# Altium schematic sheet RGB Video Controller.SchDoc: RGB Video Controller
size A4; Organization: Altium Limited; Address1: L3, 12a Rodborough Rd; Address2: Frenchs Forest; Address3: NSW; Address4: Australia 2086; Revision: 1; SheetNumber: 5; SheetTotal: 11; Alumno: Diego Caceres; Curso: R1051; Materia: Sistemas de Representación; Docentes: Ing. Perdomo, Ing. Fuoco, Ing. Giorno, Sr. Vergili
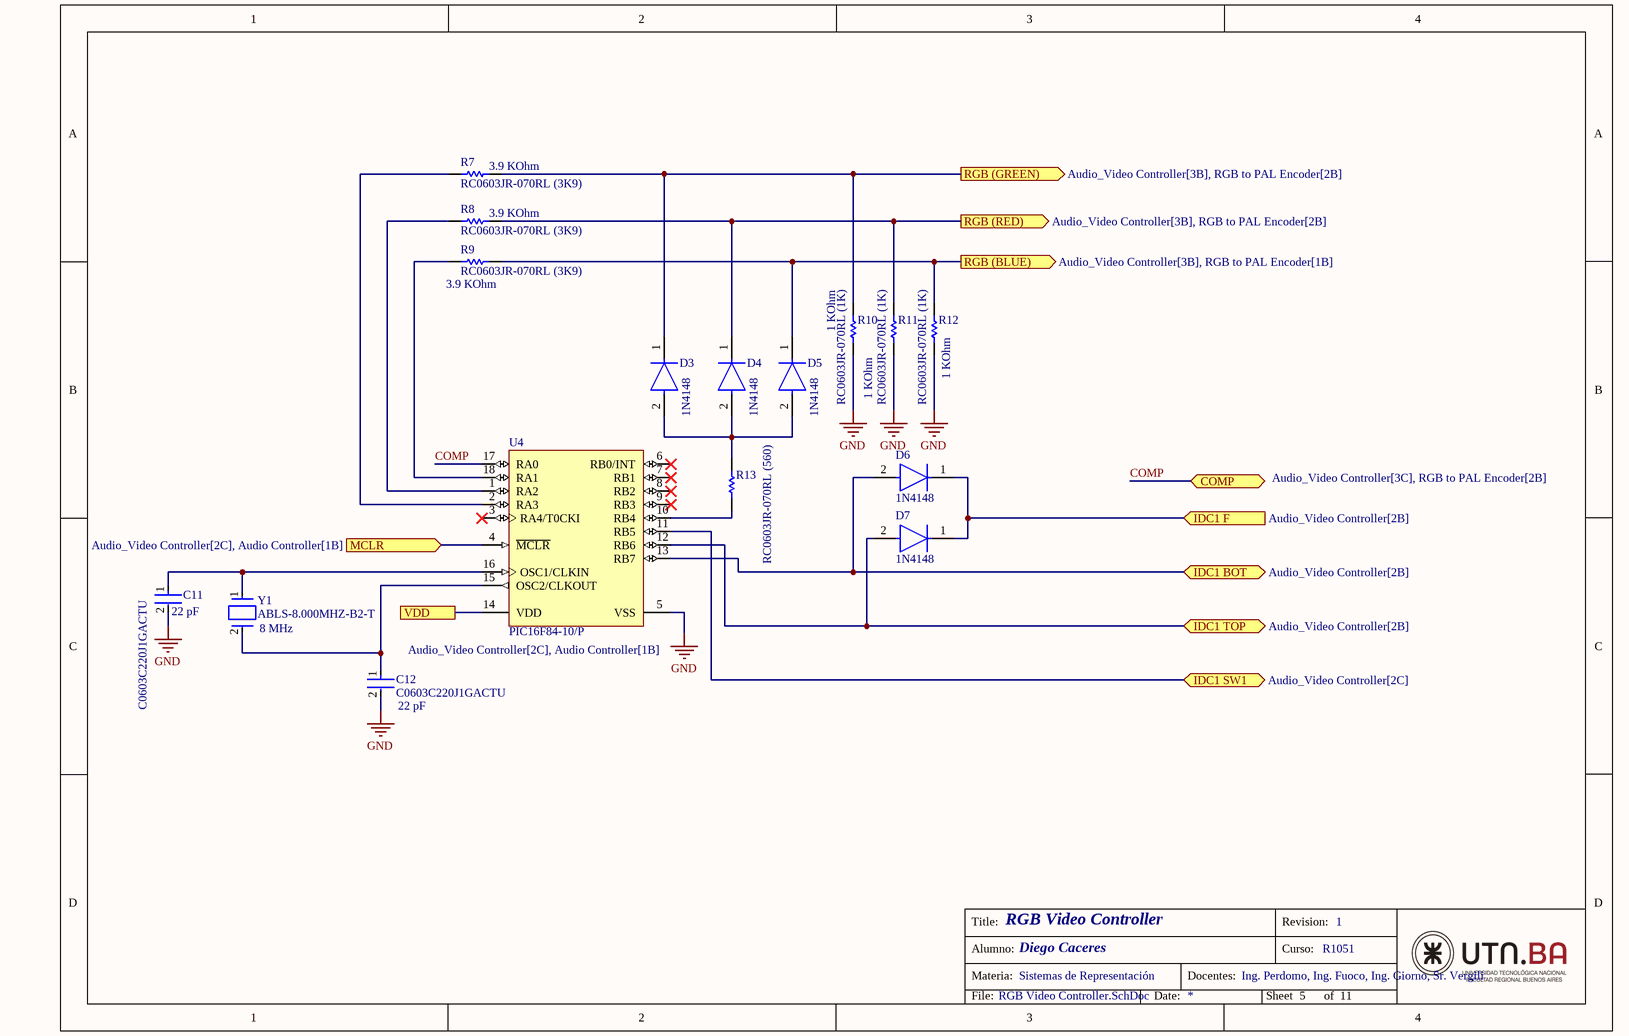
[diagram p0: RGB Video Controller.SchDoc]

## Parts
C11  C0603C220J1GACTU  value 22 pF  [FP-C0603C-CF-MFG]
C12  C0603C220J1GACTU  value 22 pF  [FP-C0603C-CF-MFG]
D3  1N4148  [FP-017AG-MFG]
D4  1N4148  [FP-017AG-MFG]
D5  1N4148  [FP-017AG-MFG]
D6  1N4148  [FP-017AG-MFG]
D7  1N4148  [FP-017AG-MFG]
R7  RC0603JR-070RL (3K9)  Resistance: 3.9 KOhm  [RESC1608X55X25ML10T15]
R8  RC0603JR-070RL (3K9)  Resistance: 3.9 KOhm  [RESC1608X55X25ML10T15]
R9  RC0603JR-070RL (3K9)  Resistance: 3.9 KOhm  [RESC1608X55X25ML10T15]
R10  RC0603JR-070RL (1K)  Resistance: 1 KOhm  [RESC1608X55X25ML10T15]
R11  RC0603JR-070RL (1K)  Resistance: 1 KOhm  [RESC1608X55X25ML10T15]
R12  RC0603JR-070RL (1K)  Resistance: 1 KOhm  [RESC1608X55X25ML10T15]
R13  RC0603JR-070RL (560)  [RESC1608X55X25ML10T15]
U4  PIC16F84-10/P  [MCHP-PDIP-P18]
Y1  ABLS-8.000MHZ-B2-T  Operating Frequency: 8 MHz  [FP-ABLS-MFG]

## Ports
COMP (bidir, see Audio_Video Controller[3C], RGB to PAL Encoder[2B]), IDC1 BOT (bidir, see Audio_Video Controller[2B]), IDC1 F (in, see Audio_Video Controller[2B]), IDC1 SW1 (bidir, see Audio_Video Controller[2C]), IDC1 TOP (bidir, see Audio_Video Controller[2B]), MCLR (in, see Audio_Video Controller[2C], Audio Controller[1B]), RGB (BLUE) (out, see Audio_Video Controller[3B], RGB to PAL Encoder[1B]), RGB (GREEN) (out, see Audio_Video Controller[3B], RGB to PAL Encoder[2B]), RGB (RED) (out, see Audio_Video Controller[3B], RGB to PAL Encoder[2B]), VDD (see Audio_Video Controller[2C], Audio Controller[1B])

## Nets
GND: C11.2 C12.2 R10.2 R11.2 R12.2 U4.5(VSS)
COMP: U4.17(RA0) ; port COMP
IDC1 BOT: D6.2(A) U4.13(RB7) ; port IDC1 BOT
IDC1 F: D6.1(C) D7.1(C) ; port IDC1 F
IDC1 SW1: U4.11(RB5) ; port IDC1 SW1
IDC1 TOP: D7.2(A) U4.12(RB6) ; port IDC1 TOP
MCLR: U4.4(~{MCLR}) ; port MCLR
RGB (BLUE): D5.1(C) R9.1 R12.1 ; port RGB (BLUE)
RGB (GREEN): D3.1(C) R7.1 R10.1 ; port RGB (GREEN)
RGB (RED): D4.1(C) R8.1 R11.1 ; port RGB (RED)
VDD: U4.14(VDD) ; port VDD
NetC11_1: C11.1 U4.16(OSC1/CLKIN) Y1.1
NetC12_1: C12.1 U4.15(OSC2/CLKOUT) Y1.2
NetD3_2: D3.2(A) D4.2(A) D5.2(A) R13.1
NetR7_2: R7.2 U4.2(RA3)
NetR8_2: R8.2 U4.1(RA2)
NetR9_2: R9.2 U4.18(RA1)
NetR13_2: R13.2 U4.10(RB4)

Not connected (* = marked no-connect by the designer): U4 3(RA4/T0CKI)* 6(RB0/INT)* 7(RB1)* 8(RB2)* 9(RB3)*

## Notes on the sheet
- Title:
- Revision:
- Alumno:
- Materia:
- Docentes:
- Curso:
- File:
- Date:
- Sheet
- of

## Library data of the parts
C11 C12 = CMP-2006-03322-2: CAP CER 22PF 100V 5% NP0 0603; Manufacturer: KEMET; Material: Ceramic; Automotive Grade: Grade 1; Temperature Characteristic: C0G; Temperature Coefficient: 30ppm/°C; Tolerance: 0.05; Temperature Range High: +125°C; Capacitance: 22 pF; ComponentLink2URL: https://api.kemet.com/component-edge/download/datasheet/C0603C100J5GACAUTO.pdf; Package: C0603C-CF; Category: Cap; Voltage Rating: 100 V; Automotive: Yes; Mouser Description: Multilayer Ceramic Capacitors MLCC - SMD/SMT 100volts 22pF C0G 5%; Device Class L1: Passive Components; Device Class L3: Ceramic Capacitors; Temperature: -55°C to +125°C; Digikey Description: CAP CER 22PF 100V 5% NP0 0603; RoHS: TRUE; ComponentLink2Description: Datasheet; Height: 0.87mm; Temperature Range Low: -55°C; Manufacturer Part Number: C0603C220J1GACTU; Device Class L2: Capacitors; Octopart: https://octopart.com/c0603c220j1gactu-kemet-9142653; Lead Free: Yes
D3-D7 = CMP-07163-000046-1: DIODE GEN PURP 100V 200MA DO35; Forward Voltage: 1V; Max Power Dissipation: 500mW; Max Reverse Current: 5uA; Forward Current: 300mA; Current: 4A; Reverse Recovery Time: 4ns; Element Configuration: Single; Outside Diameter: 1.85mm; Capacitance: 4pF; Polarity: Standard; Max Forward Surge Current (Ifsm): 1A; Reverse Voltage: 100V; Output Current: 200mA; Average Rectified Current: 200mA; Diameter: 1.91mm; Max Repetitive Reverse Voltage (Vrrm): 100V; Current Rating: 200mA; Case/Package: DO-35; Lead Free: Lead Free; Number of Pins: 2; Recovery Time: 4ns; Packaging: Bulk; Contact Plating: Tin; Voltage: 100V; Mount: Through Hole; Max Surge Current: 4A; Package Quantity: 2000; Width: 1.91mm; Max Reverse Voltage (DC): 100V; Length: 4.56mm; Radiation Hardening: No; Power Dissipation: 500mW; Voltage Rating (DC): 100V; Peak Non-Repetitive Surge Current: 4A; REACH SVHC: No SVHC; Height: 4.56mm; Max Operating Temperature: 175°C; Series: -; Weight: 0.01lb; Min Operating Temperature: -65°C
R7-R12 = CMP-2100-03667-1: Chip Resistor, 0 Ohm, +/- 5%, 0.1 W, -55 to 155 degC, 0603 (1608 Metric), RoHS, Tape and Reel; Manufacturer: Yageo; Temperature Coefficient: 200ppm/degreesC; Voltage Rating: 50V; Power Rating: 100mW; Width: 0.8mm; Max Operating Temperature: 155degC; Tolerance: 5%; Package Reference: 0603; Height: 0.45mm; Depth: 0.8mm; Package Description: 2-Pin Surface Mount Device, Body 1.6 x 0.8 mm; Termination: SMD/SMT; Package Quantity: 5000; Case/Package: 0603; Case Code (Imperial): 0603; Radiation Hardening: No; Number of Pins: 2; Length: 1.6mm; Lead Free: LeadFree; Voltage Rating (DC): 50V; Military Standard: Not; Datasheet URL: http://www.yageo.com/NewPortal/yageodocoutput?fileName=/pdf/R-Chip/PYu-RC_Group_51_RoHS_L_5.pdf; Manufacturer URL: http://www.yageo.com/; Packaging: TapeandReel; Case Code (Metric): 1608; Min Operating Temperature: -55degC; Composition: ThickFilm; RoHSCompliant: true; Contact Plating: Tin; Datasheet Version: Rev. 5, 10/2016; REACH SVHC: NoSVHC
R13 = CMP-2100-03667-1: Chip Resistor, 0 Ohm, +/- 5%, 0.1 W, -55 to 155 degC, 0603 (1608 Metric), RoHS, Tape and Reel; Manufacturer: Yageo; Temperature Coefficient: 200ppm/degreesC; Voltage Rating: 50V; Power Rating: 100mW; Resistance: 0mOhm; Width: 0.8mm; Max Operating Temperature: 155degC; Tolerance: 5%; Package Reference: 0603; Height: 0.45mm; Depth: 0.8mm; Package Description: 2-Pin Surface Mount Device, Body 1.6 x 0.8 mm; Termination: SMD/SMT; Package Quantity: 5000; Case/Package: 0603; Case Code (Imperial): 0603; Radiation Hardening: No; Number of Pins: 2; Length: 1.6mm; Lead Free: LeadFree; Voltage Rating (DC): 50V; Military Standard: Not; Datasheet URL: http://www.yageo.com/NewPortal/yageodocoutput?fileName=/pdf/R-Chip/PYu-RC_Group_51_RoHS_L_5.pdf; Manufacturer URL: http://www.yageo.com/; Packaging: TapeandReel; Case Code (Metric): 1608; Min Operating Temperature: -55degC; Composition: ThickFilm; RoHSCompliant: true; Contact Plating: Tin; Datasheet Version: Rev. 5, 10/2016; REACH SVHC: NoSVHC
U4 = CMP-0115-01673-1: Flash / EEPROM 8-Bit Microcontroller, 10 MHz, 13 I/O, 0 to 70 degC, 18-pin PDIP (P18), Tube; Manufacturer: Microchip; Digital Communication: 0 -UART, 0 -A/E/USART, 0 -SPI, 0 -I2C, 0 -MSSP(SPI/I2C), 0 -SSP(SPI/I2C); I/O Pins: 13; Program Memory KWords: 1; Max. CPU Speed MHz: 10; Timers: 1 - 8-bit, 0 - 16-bit; EEPROM Data Memory (bytes): 64; Operation Voltage Range: 2V - 6V; RAM: 68; Program Memory KBytes: 1.75; ComponentLink2Description: Package Specification; PackageReference: PDIP-P18; ComponentLink3Description: URL Link1; ComponentLink1Description: Datasheet; ComponentLink3URL: Product URL:http://www.microchip.com/datasheet/PIC16F84; RoHS: TRUE; PackageDescription: 18-Lead Plastic Dual In-Line, Row Spacing 7.62 mm, 22.86 x 6.6 mm Body, 2.54 mm Pitch; DatasheetVersion: Rev. D; Mounting Technology: Through Hole; PackageVersion: C04-007B, 12/2012; Packing: TUBE; ComponentLink1URL: http://ww1.microchip.com/downloads/en/DeviceDoc/30430D.pdf; Memory Type: Flash; PartNumber: PIC16F84-10/P; ComponentLink2URL: http://www.microchip.com/stellent/groups/techpub_sg/documents/packagingspec/en012702.pdf
Y1 = CMP-27762-009874-1: CRYSTAL 8.0000MHZ 18PF SMD; ESR (Equivalent Series Resistance): 80R; Frequency Stability: 50ppm; Tolerance: 20ppm; Frequency: 8MHz; Min Operating Temperature: -20°C; Lead Free: Lead Free; Width: 4.7mm; Packaging: Tape and Reel; Series: ABLS; Accuracy: 20ppm; Length: 11.4mm; Frequency Tolerance: 20ppm; Termination: SMD/SMT; Number of Pins: 2; Radiation Hardening: No; Depth: 4.7mm; REACH SVHC: No SVHC; Contact Plating: Tin; Load Capacitance: 18pF; Case/Package: SMD/SMT; Mount: Surface Mount; Package Quantity: 1000; Max Operating Temperature: 70°C; Height: 0.165inch; Series Resistance: 80R